# Altium schematic sheet DIFFAMP.SchDoc
size A4; SheetNumber: 3; SheetTotal: 3
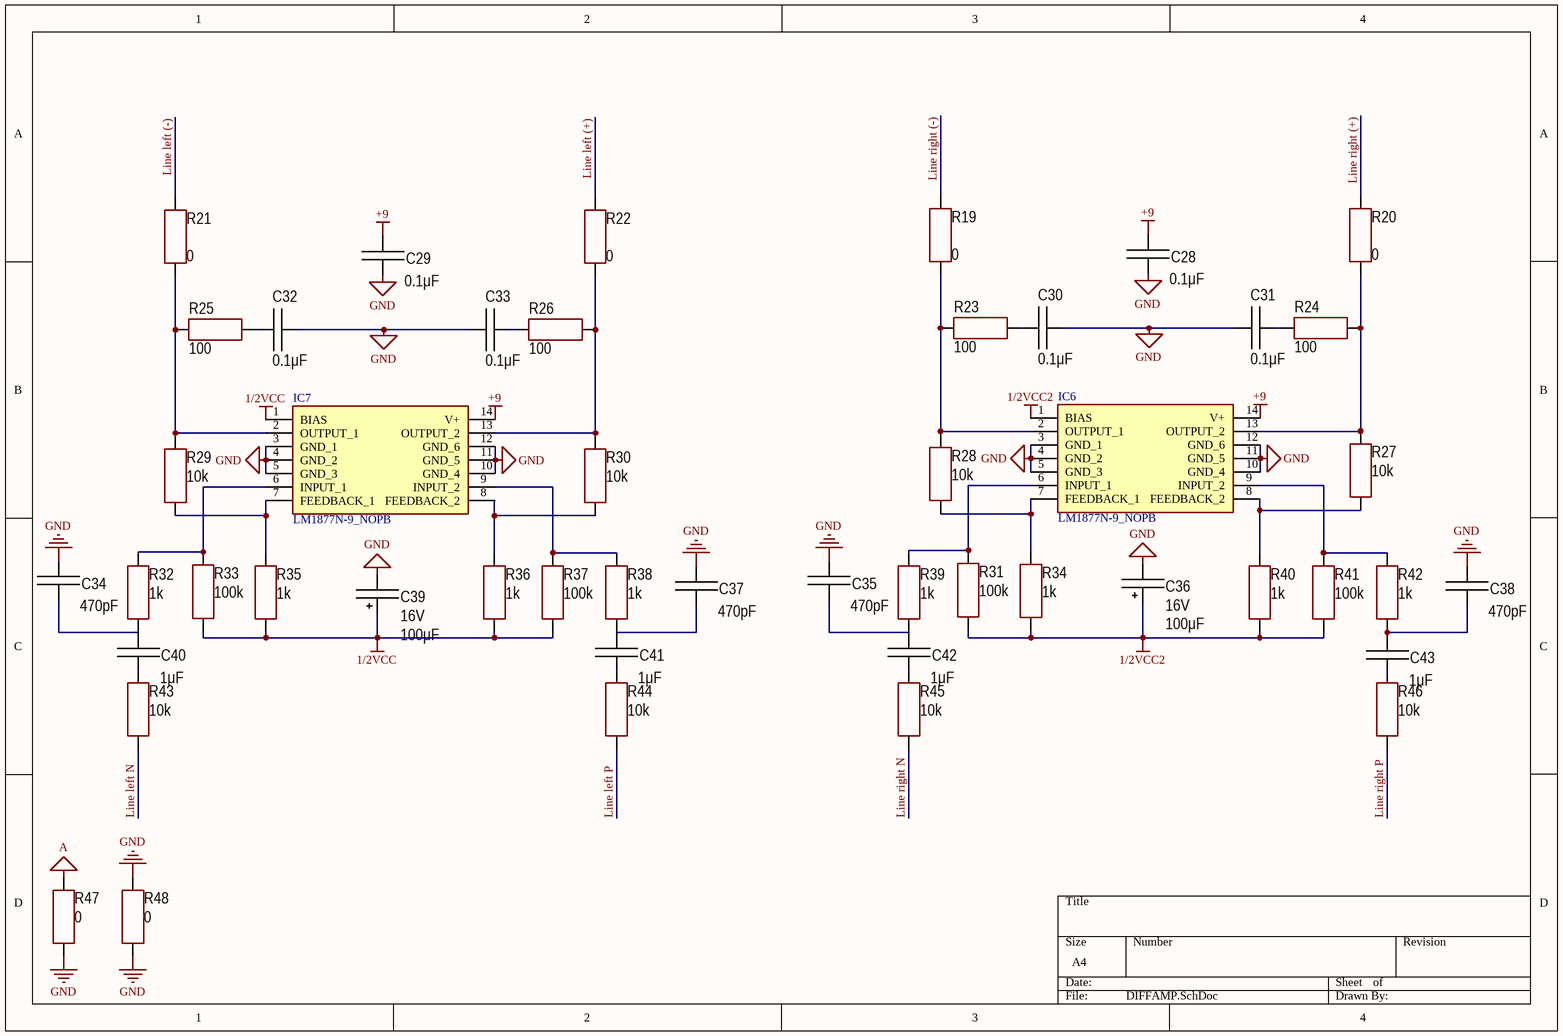
[diagram p0: DIFFAMP.SchDoc]

## Parts
C28  value 0.1μF  [CAP: 0805]
C29  value 0.1μF  [CAP: 0805]
C30  value 0.1μF  [CAP: 0805]
C31  value 0.1μF  [CAP: 0805]
C32  value 0.1μF  [CAP: 0805]
C33  value 0.1μF  [CAP: 0805]
C34  value 470pF  [CAP: 0805]
C35  value 470pF  [CAP: 0805]
C36  value 100μF  Voltage: 16V  [CAP: TANTAL-D]
C37  value 470pF  [CAP: 0805]
C38  value 470pF  [CAP: 0805]
C39  value 100μF  Voltage: 16V  [CAP: TANTAL-D]
C40  value 1μF  [CAP: 0805]
C41  value 1μF  [CAP: 0805]
C42  value 1μF  [CAP: 0805]
C43  value 1μF  [CAP: 0805]
IC6  LM1877N-9_NOPB  [DIP787W58P254L1918H508Q14N]
IC7  LM1877N-9_NOPB  [DIP787W58P254L1918H508Q14N]
R19  value 0  [RES: 0805]
R20  value 0  [RES: 0805]
R21  value 0  [RES: 0805]
R22  value 0  [RES: 0805]
R23  value 100  [RES: 0805]
R24  value 100  [RES: 0805]
R25  value 100  [RES: 0805]
R26  value 100  [RES: 0805]
R27  value 10k  [RES: 0805]
R28  value 10k  [RES: 0805]
R29  value 10k  [RES: 0805]
R30  value 10k  [RES: 0805]
R31  value 100k  [RES: 0805]
R32  value 1k  [RES: 0805]
R33  value 100k  [RES: 0805]
R34  value 1k  [RES: 0805]
R35  value 1k  [RES: 0805]
R36  value 1k  [RES: 0805]
R37  value 100k  [RES: 0805]
R38  value 1k  [RES: 0805]
R39  value 1k  [RES: 0805]
R40  value 1k  [RES: 0805]
R41  value 100k  [RES: 0805]
R42  value 1k  [RES: 0805]
R43  value 10k  [RES: 0805]
R44  value 10k  [RES: 0805]
R45  value 10k  [RES: 0805]
R46  value 10k  [RES: 0805]
R47  value 0  [RES: 0805]
R48  value 0  [RES: 0805]

## Nets
1/2VCC: C39.1 IC7.1(BIAS) R33.2 R35.2 R36.1 R37.2
1/2VCC2: C36.1 IC6.1(BIAS) R31.2 R34.2 R40.1 R41.2
+9: C28.2 C29.2 IC6.14(V+) IC7.14(V+)
A: R47.1
GND: C28.1 C29.1 C30.1 C31.1 C32.1 C33.1 C34.2 C35.2 C36.2 C37.2 C38.2 C39.2 IC6.3(GND_1) IC6.4(GND_2) IC6.5(GND_3) IC6.10(GND_4) IC6.11(GND_5) IC6.12(GND_6) IC7.3(GND_1) IC7.4(GND_2) IC7.5(GND_3) IC7.10(GND_4) IC7.11(GND_5) IC7.12(GND_6) R47.2 R48.1 R48.2
Line left (+): R22.2
Line left (-): R21.2
Line left N: R43.2
Line left P: R44.2
Line right (+): R20.2
Line right (-): R19.2
Line right N: R45.2
Line right P: R46.2
NetC30_2: C30.2 R23.1
NetC31_2: C31.2 R24.2
NetC32_2: C32.2 R25.1
NetC33_2: C33.2 R26.2
NetC34_1: C34.1 C40.2 R32.2
NetC35_1: C35.1 C42.2 R39.2
NetC37_1: C37.1 C41.2 R38.2
NetC38_1: C38.1 C43.2 R42.2
NetC40_1: C40.1 R43.1
NetC41_1: C41.1 R44.1
NetC42_1: C42.1 R45.1
NetC43_1: C43.1 R46.1
NetIC6_2: IC6.2(OUTPUT_1) R19.1 R23.2 R28.1
NetIC6_6: IC6.6(INPUT_1) R31.1 R39.1
NetIC6_7: IC6.7(FEEDBACK_1) R28.2 R34.1
NetIC6_8: IC6.8(FEEDBACK_2) R27.2 R40.2
NetIC6_9: IC6.9(INPUT_2) R41.1 R42.1
NetIC6_13: IC6.13(OUTPUT_2) R20.1 R24.1 R27.1
NetIC7_2: IC7.2(OUTPUT_1) R21.1 R25.2 R29.1
NetIC7_6: IC7.6(INPUT_1) R32.1 R33.1
NetIC7_7: IC7.7(FEEDBACK_1) R29.2 R35.1
NetIC7_8: IC7.8(FEEDBACK_2) R30.2 R36.2
NetIC7_9: IC7.9(INPUT_2) R37.1 R38.1
NetIC7_13: IC7.13(OUTPUT_2) R22.1 R26.1 R30.1

## Library data of the parts
C28-C33 = Ceramic_0805: Manufacturer: Yageo; PartNumber: CC0805KRX7R7BB104; ValueManufacturerPartNumber: Ceramic capacitor, 0.1μF, X7R, ±10%, 16V, 0805, -55...+125°C; TypeCapacitor: Ceramic capacitor; Tolerance: ±10%; TypeDielectric: X7R; Voltage: 16V; Package: 0805; HelpURL: https://www.digikey.com/product-detail/en/yageo/CC0805KRX7R7BB104/311-1142-1-ND/303052; Temperature: -55...+125°C
C34 C35 C37 C38 = Ceramic_0805: Manufacturer: Yageo; PartNumber: CC0805KRX7R7BB104; ValueManufacturerPartNumber: Ceramic capacitor, 470pF, X7R, ±10%, 16V, 0805, -55...+125°C; TypeCapacitor: Ceramic capacitor; Tolerance: ±10%; TypeDielectric: X7R; Voltage: 16V; Package: 0805; HelpURL: https://www.digikey.com/product-detail/en/yageo/CC0805KRX7R7BB104/311-1142-1-ND/303052; Temperature: -55...+125°C
C36 C39 = Tantal_D: Manufacturer: AVX; PartNumber: TAJD476M035RNJV; ValueManufacturerPartNumber: Tantalum capacitor, 100μF, 16V, ±20%, 900mOhm, case D (7343), -55...+125°C; Impedance: 900mOhm; Tolerance: ±20%; TypeDielectric: X7R; TypeCapacitor: Tantalum capacitor; Package: case D (7343); HelpURL: https://www.digikey.com/product-detail/en/avx-corporation/TAJD476M035RNJV/478-12122-1-ND/8605695; Temperature: -55...+125°C
C40-C43 = Ceramic_0805: Manufacturer: Yageo; PartNumber: CC0805KRX7R7BB104; ValueManufacturerPartNumber: Ceramic capacitor, 1μF, X7R, ±10%, 16V, 0805, -55...+125°C; TypeCapacitor: Ceramic capacitor; Tolerance: ±10%; TypeDielectric: X7R; Voltage: 16V; Package: 0805; HelpURL: https://www.digikey.com/product-detail/en/yageo/CC0805KRX7R7BB104/311-1142-1-ND/303052; Temperature: -55...+125°C
IC6 IC7 = LM1877N-9_NOPB: Integrated Circuit; Manufacturer_Name: Texas Instruments; Manufacturer_Part_Number: LM1877N-9/NOPB; Datasheet Link: http://www.datasheetlib.com/datasheet/52991/lm1877n-9-nopb_national-semiconductor/download.html; Height: 5.08mm; Mouser Part Number: N/A; Mouser Price/Stock: https://www.mouser.com/Search/Refine.aspx?Keyword=N%2FA
R19-R22 R47 R48 = Resistor_0805: Manufacturer: Yageo; PartNumber: RC0805JR-07100RL; ValueManufacturerPartNumber: Resistor film, 0, ±5%, 0805, 0.125W, -55...+125°C; TypeResistor: Resistor film; Power: 0.125W; Tolerance: ±5%; Package: 0805; HelpURL: https://www.digikey.com/product-detail/en/yageo/RC0805JR-07100RL/311-100ARCT-ND/731185; Temperature: -55...+125°C
R23-R26 = Resistor_0805: Manufacturer: Yageo; PartNumber: RC0805JR-07100RL; ValueManufacturerPartNumber: Resistor film, 100, ±5%, 0805, 0.125W, -55...+125°C; TypeResistor: Resistor film; Power: 0.125W; Tolerance: ±5%; Package: 0805; HelpURL: https://www.digikey.com/product-detail/en/yageo/RC0805JR-07100RL/311-100ARCT-ND/731185; Temperature: -55...+125°C
R27-R30 R43-R46 = Resistor_0805: Manufacturer: Yageo; PartNumber: RC0805JR-07100RL; ValueManufacturerPartNumber: Resistor film, 10k, ±5%, 0805, 0.125W, -55...+125°C; TypeResistor: Resistor film; Power: 0.125W; Tolerance: ±5%; Package: 0805; HelpURL: https://www.digikey.com/product-detail/en/yageo/RC0805JR-07100RL/311-100ARCT-ND/731185; Temperature: -55...+125°C
R31 R33 R37 R41 = Resistor_0805: Manufacturer: Yageo; PartNumber: RC0805JR-07100RL; ValueManufacturerPartNumber: Resistor film, 100k, ±5%, 0805, 0.125W, -55...+125°C; TypeResistor: Resistor film; Power: 0.125W; Tolerance: ±5%; Package: 0805; HelpURL: https://www.digikey.com/product-detail/en/yageo/RC0805JR-07100RL/311-100ARCT-ND/731185; Temperature: -55...+125°C
R32 R34-R36 R38-R40 R42 = Resistor_0805: Manufacturer: Yageo; PartNumber: RC0805JR-07100RL; ValueManufacturerPartNumber: Resistor film, 1k, ±5%, 0805, 0.125W, -55...+125°C; TypeResistor: Resistor film; Power: 0.125W; Tolerance: ±5%; Package: 0805; HelpURL: https://www.digikey.com/product-detail/en/yageo/RC0805JR-07100RL/311-100ARCT-ND/731185; Temperature: -55...+125°C